# Altium schematic sheet Digital_PWR.SchDoc: uSDR schematic
size Letter; Author: Ye-sheng Kuo; CompanyName: Univ. of Michigan; Revision: 2.0; SheetNumber: 12; SheetTotal: 16
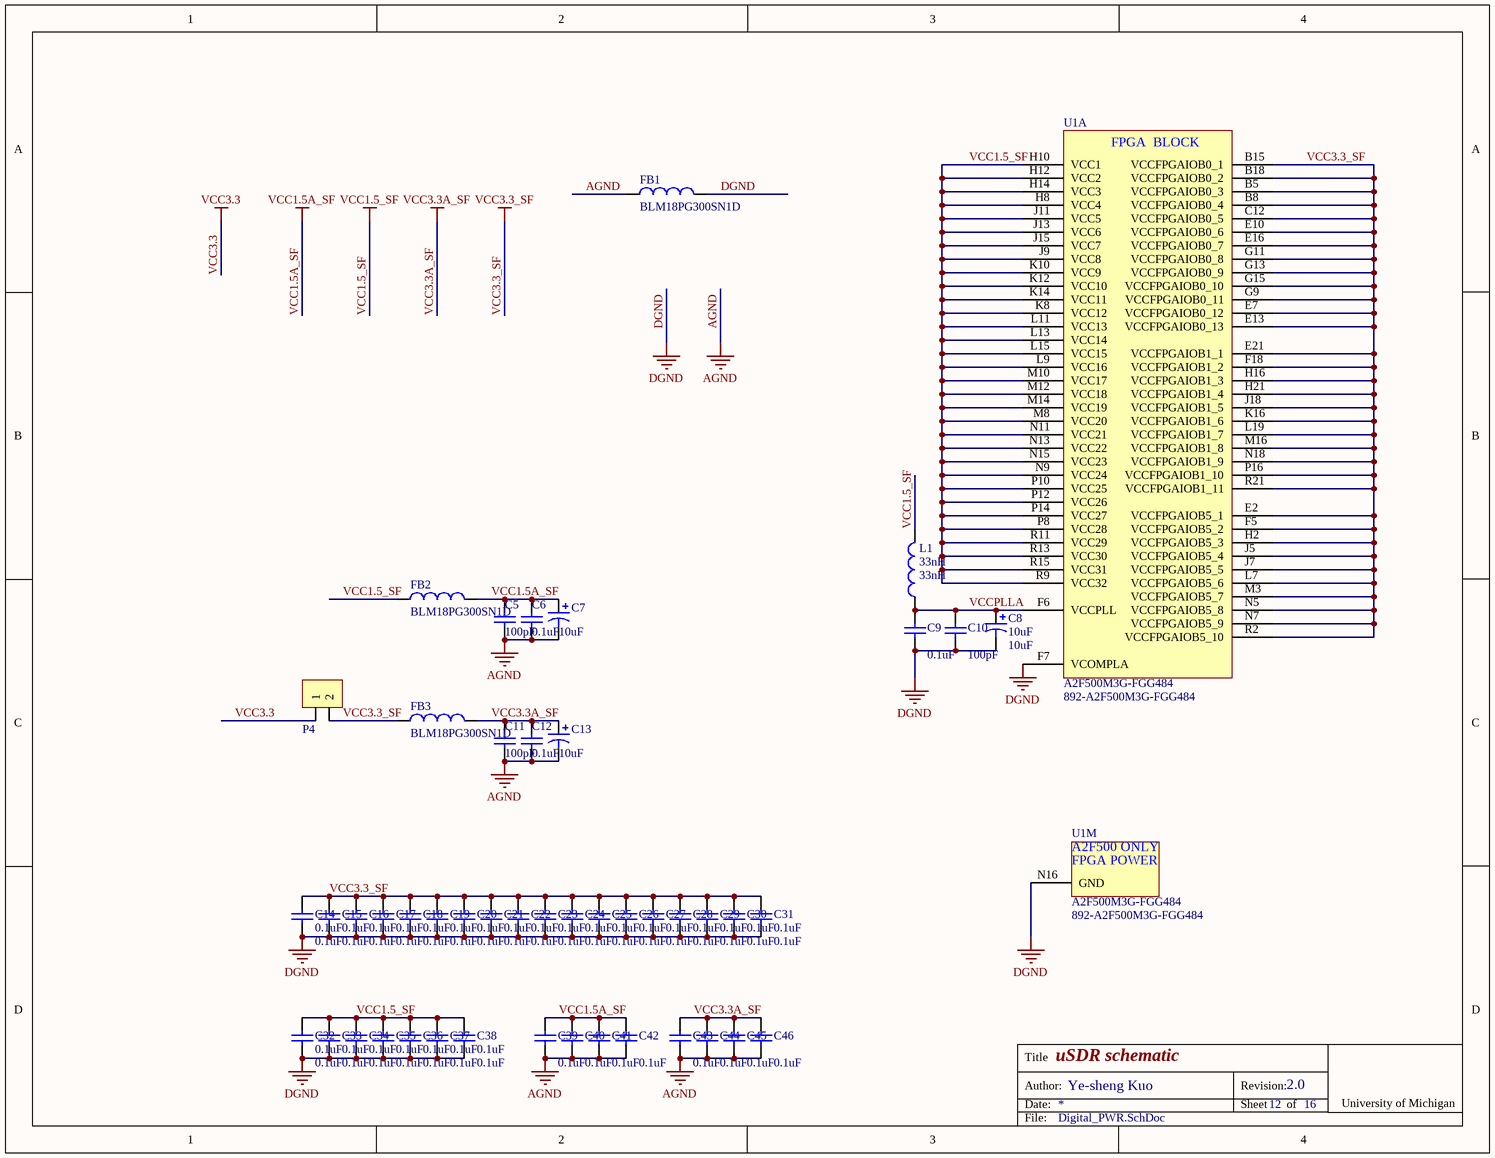
[diagram p0: Digital_PWR.SchDoc]

## Parts
C5  100pF  [0402]
C6  0.1uF  [0402]
C7  10uF  [C0805]
C8  10uF  [C0805]
C9  0.1uF  [0402]
C10  100pF  [0402]
C11  100pF  [0402]
C12  0.1uF  [0402]
C13  10uF  [C0805]
C14  0.1uF  [0402]
C15  0.1uF  [0402]
C16  0.1uF  [0402]
C17  0.1uF  [0402]
C18  0.1uF  [0402]
C19  0.1uF  [0402]
C20  0.1uF  [0402]
C21  0.1uF  [0402]
C22  0.1uF  [0402]
C23  0.1uF  [0402]
C24  0.1uF  [0402]
C25  0.1uF  [0402]
C26  0.1uF  [0402]
C27  0.1uF  [0402]
C28  0.1uF  [0402]
C29  0.1uF  [0402]
C30  0.1uF  [0402]
C31  0.1uF  [0402]
C32  0.1uF  [0402]
C33  0.1uF  [0402]
C34  0.1uF  [0402]
C35  0.1uF  [0402]
C36  0.1uF  [0402]
C37  0.1uF  [0402]
C38  0.1uF  [0402]
C39  0.1uF  [0402]
C40  0.1uF  [0402]
C41  0.1uF  [0402]
C42  0.1uF  [0402]
C43  0.1uF  [0402]
C44  0.1uF  [0402]
C45  0.1uF  [0402]
C46  0.1uF  [0402]
FB1  BLM18PG300SN1D  [1608[0603]]
FB2  BLM18PG300SN1D  [1608[0603]]
FB3  BLM18PG300SN1D  [1608[0603]]
L1  33nH  [0402]
P4  1 x 2 header  [1x2 header]  (value not drawn)
U1  A2F500M3G-FGG484  Supplier Part Number 1: 892-A2F500M3G-FGG484  [BGA100P22X22-484N]  (parts A,M of 13)

## Nets
AGND: C5.1 C6.1 C7.2 C11.1 C12.1 C13.2 C39.1 C40.1 C41.1 C42.1 C43.1 C44.1 C45.1 C46.1 FB1.1
DGND: C8.2 C9.1 C10.1 C14.1 C15.1 C16.1 C17.1 C18.1 C19.1 C20.1 C21.1 C22.1 C23.1 C24.1 C25.1 C26.1 C27.1 C28.1 C29.1 C30.1 C31.1 C32.1 C33.1 C34.1 C35.1 C36.1 C37.1 C38.1 FB1.2 U1.F7(VCOMPLA) U1.N16(GND)
VCC1.5_SF: C32.2 C33.2 C34.2 C35.2 C36.2 C37.2 C38.2 FB2.1 L1.2 U1.H8(VCC4) U1.H10(VCC1) U1.H12(VCC2) U1.H14(VCC3) U1.J9(VCC8) U1.J11(VCC5) U1.J13(VCC6) U1.J15(VCC7) U1.K8(VCC12) U1.K10(VCC9) U1.K12(VCC10) U1.K14(VCC11) U1.L9(VCC16) U1.L11(VCC13) U1.L13(VCC14) U1.L15(VCC15) U1.M8(VCC20) U1.M10(VCC17) U1.M12(VCC18) U1.M14(VCC19) U1.N9(VCC24) U1.N11(VCC21) U1.N13(VCC22) U1.N15(VCC23) U1.P8(VCC28) U1.P10(VCC25) U1.P12(VCC26) U1.P14(VCC27) U1.R9(VCC32) U1.R11(VCC29) U1.R13(VCC30) U1.R15(VCC31)
VCC1.5A_SF: C5.2 C6.2 C7.1 C39.2 C40.2 C41.2 C42.2 FB2.2
VCC3.3: P4.1
VCC3.3_SF: C14.2 C15.2 C16.2 C17.2 C18.2 C19.2 C20.2 C21.2 C22.2 C23.2 C24.2 C25.2 C26.2 C27.2 C28.2 C29.2 C30.2 C31.2 FB3.1 P4.2 U1.B5(VCCFPGAIOB0_3) U1.B8(VCCFPGAIOB0_4) U1.B15(VCCFPGAIOB0_1) U1.B18(VCCFPGAIOB0_2) U1.C12(VCCFPGAIOB0_5) U1.E2(VCCFPGAIOB5_1) U1.E7(VCCFPGAIOB0_12) U1.E10(VCCFPGAIOB0_6) U1.E13(VCCFPGAIOB0_13) U1.E16(VCCFPGAIOB0_7) U1.E21(VCCFPGAIOB1_1) U1.F5(VCCFPGAIOB5_2) U1.F18(VCCFPGAIOB1_2) U1.G9(VCCFPGAIOB0_11) U1.G11(VCCFPGAIOB0_8) U1.G13(VCCFPGAIOB0_9) U1.G15(VCCFPGAIOB0_10) U1.H2(VCCFPGAIOB5_3) U1.H16(VCCFPGAIOB1_3) U1.H21(VCCFPGAIOB1_4) U1.J5(VCCFPGAIOB5_4) U1.J7(VCCFPGAIOB5_5) U1.J18(VCCFPGAIOB1_5) U1.K16(VCCFPGAIOB1_6) U1.L7(VCCFPGAIOB5_6) U1.L19(VCCFPGAIOB1_7) U1.M3(VCCFPGAIOB5_7) U1.M16(VCCFPGAIOB1_8) U1.N5(VCCFPGAIOB5_8) U1.N7(VCCFPGAIOB5_9) U1.N18(VCCFPGAIOB1_9) U1.P16(VCCFPGAIOB1_10) U1.R2(VCCFPGAIOB5_10) U1.R21(VCCFPGAIOB1_11)
VCC3.3A_SF: C11.2 C12.2 C13.1 C43.2 C44.2 C45.2 C46.2 FB3.2
VCCPLLA: C8.1 C9.2 C10.2 L1.1 U1.F6(VCCPLL)

## Notes on the sheet
- Title
- Date:
- Author:
- Revision:
- Sheet
- of
- University of Michigan
- File:
- (in symbol F2-200_500-FGG484_1, part A) FPGA  BLOCK
- (in symbol F2-200_500-FGG484_1, part M) A2F500 ONLY; FPGA POWER

## Library data of the parts
C5 C6 C9-C12 C14-C46 = Cap Semi: Capacitor (Semiconductor SIM Model); Published: 8-Jun-2000; LatestRevisionDate: 29-May-2009; LatestRevisionNote: IPC-7351 Footprint Added.; PackageReference: C1206; Publisher: Altium Limited; PackageDescription: Chip Capacitor
  C5 C10 C11: Value: 100pF
  C6 C9 C12 C14-C46: Value: 0.1uF
C7 C8 C13 = Cap Pol3: Polarized Capacitor (Surface Mount); Published: 8-Jun-2000; LatestRevisionDate: 29-May-2009; LatestRevisionNote: IPC-7351 Footprint Added.; PackageReference: C0805; Publisher: Altium Limited; PackageDescription: Chip Capacitor; Value: 10uF
FB1-FB3 = Ferrite Bead: FERRITE CHIP 30 OHM 1000MA 0603; Supplier 1: Digi-Key; Supplier Part Number 1: 490-1035-2-ND
L1 = Inductor: Code_IEC: 1005; Published: 8-Jun-2000; LatestRevisionDate: 29-May-2009; LatestRevisionNote: IPC-7351 Footprint Added.; PackageReference: 0402-A; Publisher: Altium Limited; PackageDescription: Chip Inductor; Code_JEITA: 0402; Value: 33nH
P4 = 1 x 2 header: 100 mils standard header
U1 = F2-200_500-FGG484_1: FPGA - Field Programmable Gate Array 500K System Gates; PPS#: P0934R; Supplier 1: Mouser